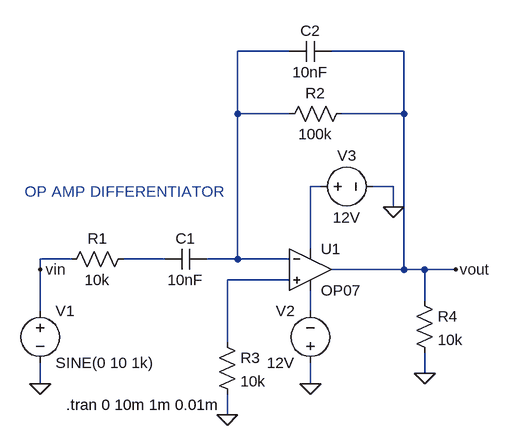
[diagram p0: schematic OP AMP Differentiator.asc]
OP AMP Differentiator.asc, the LTspice schematic file:
Version 4
SHEET 1 880 680
WIRE 80 -16 0 -16
WIRE 256 -16 144 -16
WIRE 0 80 0 -16
WIRE 80 80 0 80
WIRE 256 80 256 -16
WIRE 256 80 160 80
WIRE 128 192 112 192
WIRE 240 192 208 192
WIRE 240 224 240 192
WIRE 112 288 112 192
WIRE -256 304 -304 304
WIRE -112 304 -176 304
WIRE 0 304 0 80
WIRE 0 304 -48 304
WIRE 80 304 0 304
WIRE -304 320 -304 304
WIRE 256 320 256 80
WIRE 256 320 144 320
WIRE 288 320 256 320
WIRE 336 320 288 320
WIRE 80 336 -16 336
WIRE 288 368 288 320
WIRE -304 384 -304 320
WIRE 112 384 112 352
WIRE -16 432 -16 336
WIRE 288 480 288 448
WIRE -304 496 -304 464
WIRE 112 496 112 464
WIRE -16 544 -16 512
FLAG 240 224 0
FLAG 112 496 0
FLAG -16 544 0
FLAG -304 496 0
FLAG 336 320 vout
FLAG -304 320 vin
FLAG 288 480 0
SYMBOL OpAmps\\OP07 112 256 R0
SYMATTR InstName U1
SYMBOL cap -48 288 R90
WINDOW 0 0 32 VBottom 2
WINDOW 3 32 32 VTop 2
SYMATTR InstName C1
SYMATTR Value 10nF
SYMBOL res -160 288 R90
WINDOW 0 0 56 VBottom 2
WINDOW 3 32 56 VTop 2
SYMATTR InstName R1
SYMATTR Value 10k
SYMBOL voltage -304 368 R0
WINDOW 123 0 0 Left 0
WINDOW 39 0 0 Left 0
SYMATTR InstName V1
SYMATTR Value SINE(0 10 1k)
SYMBOL res 176 64 R90
WINDOW 0 0 56 VBottom 2
WINDOW 3 32 56 VTop 2
SYMATTR InstName R2
SYMATTR Value 100k
SYMBOL cap 144 -32 R90
WINDOW 0 0 32 VBottom 2
WINDOW 3 32 32 VTop 2
SYMATTR InstName C2
SYMATTR Value 10nF
SYMBOL res -32 416 R0
SYMATTR InstName R3
SYMATTR Value 10k
SYMBOL voltage 112 480 R180
WINDOW 0 24 96 Left 2
WINDOW 3 24 16 Left 2
SYMATTR InstName V2
SYMATTR Value 12V
SYMBOL voltage 112 192 R270
WINDOW 0 32 56 VTop 2
WINDOW 3 -32 56 VBottom 2
SYMATTR InstName V3
SYMATTR Value 12V
SYMBOL res 272 352 R0
SYMATTR InstName R4
SYMATTR Value 10k
TEXT -264 528 Left 2 !.tran 0 10m 1m 0.01m
TEXT -328 200 Left 2 ;OP AMP DIFFERENTIATOR

The netlist it stands for:
* OP AMP Differentiator.asc
XU1 N004 N001 N002 N005 vout LT1001  ; OP07, pins In+ In- V+ V- OUT
C1 N001 N003 10nF
R1 N003 vin 10k
V1 vin 0 SINE(0 10 1k)
R2 vout N001 100k
C2 vout N001 10nF
R3 N004 0 10k
V2 0 N005 12V
V3 N002 0 12V
R4 vout 0 10k
.tran 0 10m 1m 0.01m
* OP AMP DIFFERENTIATOR
.lib LTC.lib
.backanno
.end